# EAGLE design xbee_pc (EAGLE 5.10)
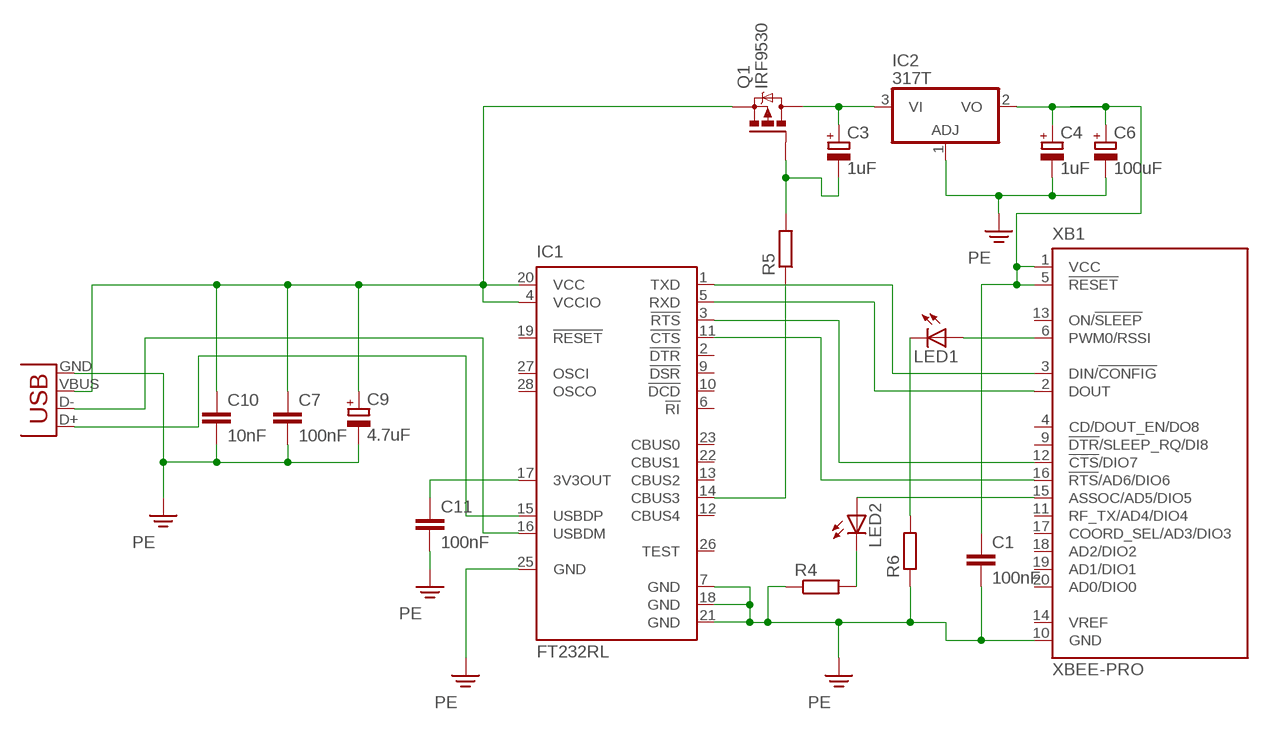
[diagram p0: schematic, sheet 1]

## Parts
C1  100nF  C-EU050-024X044  [C050-024X044]
C3  1uF  CPOL-EUE15-5AXIAL  [E15-5]
C4  1uF  CPOL-EUE15-5AXIAL  [E15-5]
C6  100uF  CPOL-EUE15-5AXIAL  [E15-5]
C7  100nF  C-EU050-024X044  [C050-024X044]
C9  4.7uF  CPOL-EUE15-5AXIAL  [E15-5]
C10  10nF  C-EU050-024X044  [C050-024X044]
C11  100nF  C-EU050-024X044  [C050-024X044]
IC1  FT232RL  [SSOP28]
IC2  317T  [TO220H]
LED1  LED3MM  [LED3MM]
LED2  LED3MM  [LED3MM]
Q1  IRF9530  [TO220BV]
R4  R-EU_M0805  [M0805]
R5  R-EU_M0805  [M0805]
R6  R-EU_M0805  [M0805]
X2  USB-SMD-NS  [USB-MINIB-NOSTOP]
XB1  XBEE-PRO  [XBEE-PRO]

## Nets
N$1: IC1.1(TXD) XB1.3(DIN/!CONFIG)
N$2: IC1.3(!RTS) XB1.12(!CTS!/DIO7)
N$3: IC1.11(!CTS) XB1.16(!RTS!/AD6/DIO6)
N$4: IC1.14(CBUS3) R5.1
N$5: C3.- Q1.G R5.2
N$6: IC1.5(RXD) XB1.2(DOUT)
N$7: C11.1 IC1.17(3V3OUT)
N$8: IC1.16(USBDM) X2.D-
N$9: C7.1 C9.+ C10.1 IC1.4(VCCIO) IC1.20(VCC) Q1.S X2.VBUS
N$10: C1.1 C4.+ C6.+ IC2.2(VO) XB1.1(VCC) XB1.5(!RESET)
N$11: IC1.15(USBDP) X2.D+
N$12: LED1.K(C) R6.2
N$13: LED1.A XB1.6(PWM0/RSSI)
N$14: LED2.A XB1.15(ASSOC/AD5/DIO5)
N$15: LED2.K(C) R4.2
N$16: C3.+ IC2.3(VI) Q1.D
PE: C1.2 C4.- C6.- C7.2 C9.- C10.2 C11.2 IC1.7(GND) IC1.18(GND) IC1.21(GND) IC1.25(GND) IC2.1(ADJ) R4.1 R6.1 X2.GND XB1.10(GND)
Unconnected: IC1.2(!DTR) IC1.6(!RI) IC1.9(!DSR) IC1.10(!DCD) IC1.12(CBUS4) IC1.13(CBUS2) IC1.19(!RESET) IC1.22(CBUS1) IC1.23(CBUS0) IC1.26(TEST) IC1.27(OSCI) IC1.28(OSCO) XB1.4(CD/DOUT_EN/DO8) XB1.9(!DTR!/SLEEP_RQ/DI8) XB1.11(RF_TX/AD4/DIO4) XB1.13(ON/!SLEEP) XB1.14(VREF) XB1.17(COORD_SEL/AD3/DIO3) XB1.18(AD2/DIO2) XB1.19(AD1/DIO1) XB1.20(AD0/DIO0)

## Library data of the parts
C1 C7 C10 C11 = rcl:C-EU: CAPACITOR, European symbol
C3 C4 C6 C9 = rcl:CPOL-EU: POLARIZED CAPACITOR, European symbol
IC1 = ftdichip:FT232R: Source: http://www.ftdichip.com/Documents/DataSheets/DS_FT232R_v104.pdf
IC2 = linear:*317: Positive VOLTAGE REGULATOR
LED1 LED2 = led:LED: LED OSRAM: - CHIPLED LG R971, LG N971, LY N971, LG Q971, LY Q971, LO R971, LY R971 LH N974, LH R974 LS Q976, LO Q976, LY Q976 LO Q996 - Hyper CHIPLED LW Q18S LB Q993, LB Q99A, LB R99A - SideLED LS A670, LO A670, LY A670, LG A670, LP A670 LB A673, LV A673, LT A673, LW A673 LH A674 LY A675 LS A676, LA A676, LO A676, LY A676, LW A676 LS A679, LY A679, LG A679 - Hyper Micro SIDELED® LS Y876, LA Y876, LO Y876, LY Y876 LT Y87S - SmartLED LW L88C, LW L88S LB L89C, LB L89S, LG L890 LS L89K, LO L89K, LY L89K LS L896, LA L896, LO L896, LY L896 - TOPLED LS T670, LO T670, LY T670, LG T670, LP T670 LSG T670, LSP T670, LSY T670, LOP T670, LYG T670 LG T671, LOG T671, LSG T671 LB T673, LV T673, LT T673, LW T673 LH T674 LS T676, LA T676, LO T676, LY T676, LB T676, LH T676, LSB T676, LW T676 LB T67C, LV T67C, LT T67C, LS T67K, LO T67K, LY T67K, LW E67C LS E67B, LA E67B, LO E67B, LY E67B, LB E67C, LV E67C, LT E67C LW T67C LS T679, LY T679, LG T679 LS T770, LO T770, LY T770, LG T770, LP T770 LB T773, LV T773, LT T773, LW T773 LH T774 LS E675, LA E675, LY E675, LS T675 LS T776, LA T776, LO T776, LY T776, LB T776 LHGB T686 LT T68C, LB T68C - Hyper Mini TOPLED® LB M676 - Mini TOPLED Santana® LG M470 LS M47K, LO M47K, LY M47K Source: http://www.osram.convergy.de LUXEON: - LUMILED® LXK2-PW12-R00, LXK2-PW12-S00, LXK2-PW14-U00, LXK2-PW14-V00 LXK2-PM12-R00, LXK2-PM12-S00, LXK2-PM14-U00 LXK2-PE12-Q00, LXK2-PE12-R00, LXK2-PE12-S00, LXK2-PE14-T00, LXK2-PE14-U00 LXK2-PB12-K00, LXK2-PB12-L00, LXK2-PB12-M00, LXK2-PB14-N00, LXK2-PB14-P00, LXK2-PB14-Q00 LXK2-PR12-L00, LXK2-PR12-M00, LXK2-PR14-Q00, LXK2-PR14-R00 LXK2-PD12-Q00, LXK2-PD12-R00, LXK2-PD12-S00 LXK2-PH12-R00, LXK2-PH12-S00 LXK2-PL12-P00, LXK2-PL12-Q00, LXK2-PL12-R00 Source: www.luxeon.com KINGBRIGHT: KA-3528ASYC Source: www.kingbright.com
Q1 = transistor-power:IRF9530: P-CHANNEL HEXFET POWER-MOS-FET Source: http://www.irf.com/product-info/datasheets/data/irf9530.pdf
R4-R6 = rcl:R-EU_: RESISTOR, European symbol
X2 = SparkFun:USB: USB Connectors USB-B-PTH is fully proven SKU : PRT-00139 USB-miniB is fully proven SKU : PRT-00587 USB-A-PCB is untested. USB-A-H is throughly reviewed, but untested. Spark Fun Electronics SKU : PRT-00437 USB-B-SMT is throughly reviewed, but untested. Needs silkscreen touching up. USB-A-S has not been used/tested USB-MB-H has not been used/tested
XB1 = maxstream:XBEE: XBee (TM) /XBee-PRO(TM) OEM RF Modules Source: MaxStream, Inc. xbee_productmanual.pdf

## Board
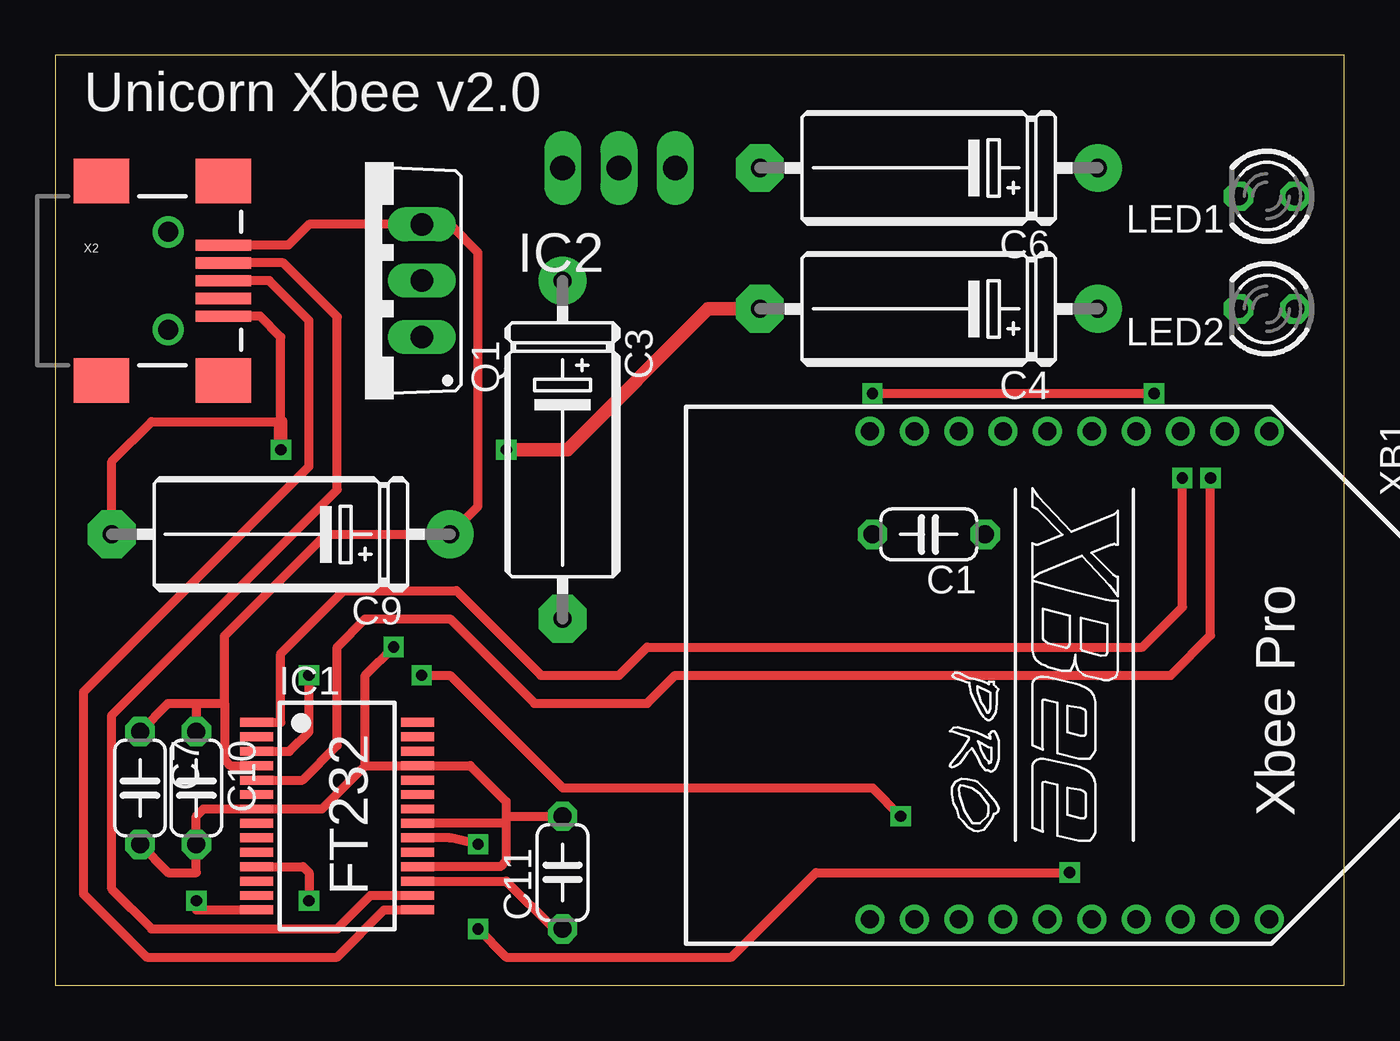
[diagram p1: board, top side]
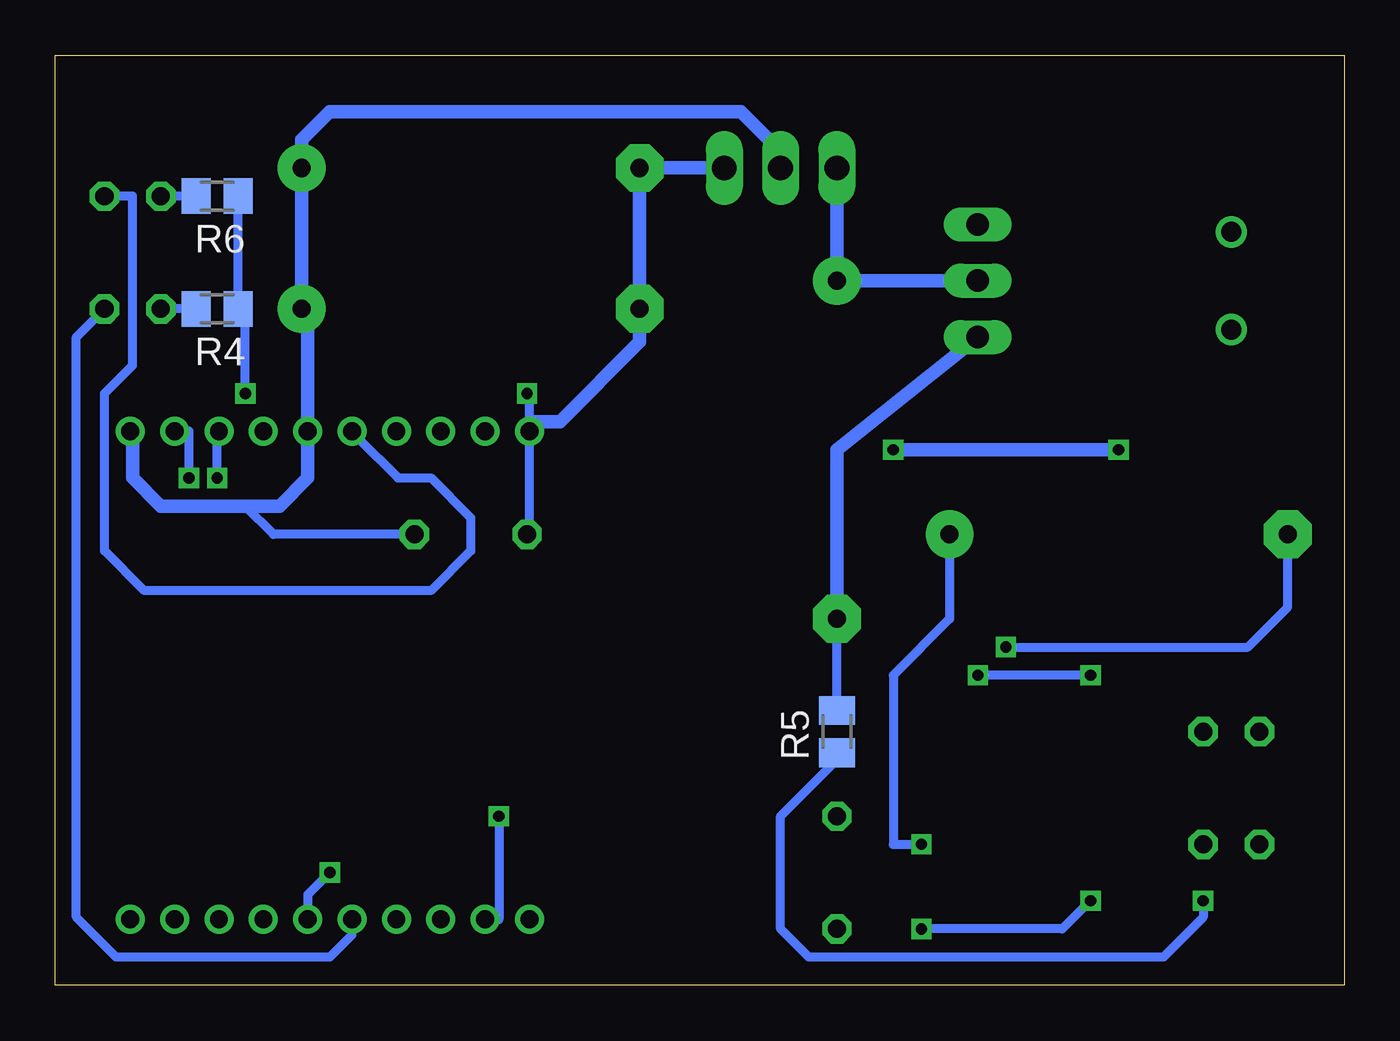
[diagram p2: board, bottom side, seen from below]

Size 58.09 x 41.9 mm. Coordinates in mm from the lower left corner, seen from the top.
Outline: 0,0 58.09,0 58.09,41.9 0,41.9 0,0
Copper layers (1*16): Top 0.035mm / dielectric 1.5mm / Bottom 0.035mm
Design rules "default": minimum track width 10mil, minimum drill 24mil, track to track 8mil, track to pad 8mil, pad to pad 8mil, via to via 8mil, smd to smd 8mil, copper to edge 40mil, drill to drill 8mil, minimum pad ring 10mil, minimum via ring 8mil, stop-mask expansion 4mil, vias tented up to drill 0mil, thermal gap 10mil

### Footprints (pad centres in the part's own frame; a part is rotated, then mirrored left to right if it is on the bottom)
C050-024X044 = drill 0.813 octagon: 1 -2.54,0; 2 2.54,0
E15-5 = drill 0.813 pad 2.159 round: + -7.62,0 | drill 0.813 pad 2.159 octagon: - 7.62,0
SSOP28 = smd 0.4 x 1.5: 1 -4.225,-3.625; 2 -3.575,-3.625; 3 -2.925,-3.625; 4 -2.275,-3.625; 5 -1.625,-3.625; 6 -0.975,-3.625; 7 -0.325,-3.625; 8 0.325,-3.625; 9 0.975,-3.625; 10 1.625,-3.625; 11 2.275,-3.625; 12 2.925,-3.625; 13 3.575,-3.625; 14 4.225,-3.625; 15 4.225,3.625; 16 3.575,3.625; 17 2.925,3.625; 18 2.275,3.625; 19 1.625,3.625; 20 0.975,3.625; 21 0.325,3.625; 22 -0.325,3.625; 23 -0.975,3.625; 24 -1.625,3.625; 25 -2.275,3.625; 26 -2.925,3.625; 27 -3.575,3.625; 28 -4.225,3.625
TO220H = drill 1.118 long: 1 -2.54,0; 2 0,0; 3 2.54,0
LED3MM = drill 0.813 octagon: A -1.27,0; K 1.27,0
TO220BV = drill 1.016 long: D 0,-2.54; G -2.54,-2.54; S 2.54,-2.54
M0805 = smd 1.3 x 1.6: 1 -0.95,0; 2 0.95,0
USB-MINIB-NOSTOP = smd 2.5 x 0.5: D+ 2.5,0; D- 2.5,0.8; GND 2.5,-1.6; ID 2.5,-0.8; VBUS 2.5,1.6 | smd 2.5 x 2: G1 -3,-4.5; G2 -3,4.5; G3 2.5,4.5; G4 2.5,-4.5 | drill 0.9 pad 0.8 round: H1 0,2.2 | drill 0.9 pad 0.787 round: H2 0,-2.2
XBEE-PRO = drill 0.8 pad 1.27 round: 1 -11,9; 2 -11,7; 3 -11,5; 4 -11,3; 5 -11,1; 6 -11,-1; 7 -11,-3; 8 -11,-5; 9 -11,-7; 10 -11,-9; 11 11,-9; 12 11,-7; 13 11,-5; 14 11,-3; 15 11,-1; 16 11,1; 17 11,3; 18 11,5; 19 11,7; 20 11,9

### Placement (x,y rotation side)
C1  39.37,20.32 180 top
C3  22.86,24.13 270 top
C4  39.37,30.48 180 top
C6  39.37,36.83 180 top
C7  3.81,8.89 270 top
C9  10.16,20.32 180 top
C10  6.35,8.89 270 top
C11  22.86,5.08 90 top
IC1  12.7,7.62 270 top
IC2  25.4,36.83 180 top
LED1  54.61,35.56 180 top
LED2  54.61,30.48 180 top
Q1  13.97,31.75 90 top
R4  50.8,30.48 180 bottom
R5  22.86,11.43 90 bottom
R6  50.8,35.56 180 bottom
X2  5.08,31.75 0 top
XB1  45.72,13.97 270 top

### Tracks (layer width: path | path; a pad name or v marks a point on that pad's centre or on a via)
N$1  (via drill 0.51)
  Top 0.406: IC1.1 10.16,11.85 10.16,14.94 13,17.78 18.08,17.78 21.89,13.97 25.4,13.97 26.67,15.24 49,15.24 50.8,17.04 v50.8,22.86
  Bottom 0.406: XB1.3 50.8,24.97 v50.8,22.86
N$2  (via drill 0.51)
  Top 0.406: v38.1,7.62 36.83,8.89 22.86,8.89 17.78,13.97 v16.51,13.97 | IC1.3 10.54,10.54 11.43,11.43 v11.43,13.97
  Bottom 0.406: XB1.12 38.1,2.97 v38.1,7.62 | v11.43,13.97 v16.51,13.97
N$3  (via drill 0.51)
  Top 0.406: IC1.11 11.16,5.34 11.43,5.08 v11.43,3.81 | v19.05,2.54 20.32,1.27 30.48,1.27 34.29,5.08 v45.72,5.08
  Bottom 0.406: v11.43,3.81 12.7,2.54 v19.05,2.54 | v45.72,5.08 46.72,4.08 XB1.16
N$4  (via drill 0.51)
  Top 0.406: IC1.14 6.35,3.4 v6.35,3.81
  Bottom 0.406: v6.35,3.81 6.35,3.07 8.15,1.27 24.13,1.27 25.4,2.54 25.4,7.62 22.86,10.16 R5.1
N$5
  Bottom 0.406: R5.2 C3.-
  Bottom 0.61: C3.- 22.86,24.13 Q1.G
N$6  (via drill 0.51)
  Top 0.406: IC1.5 11.13,9.24 12.7,10.81 12.7,15.24 13.97,16.51 17.78,16.51 21.59,12.7 26.67,12.7 27.94,13.97 50.27,13.97 52.07,15.77 v52.07,22.86
  Bottom 0.406: XB1.2 52.07,24.97 v52.07,22.86
N$7
  Top 0.406: IC1.17 20.32,4.7 22.48,2.54 C11.1
N$8
  Top 0.406: IC1.16 14.21,4.04 12.7,2.54 4.34,2.54 2.54,4.34 2.54,12.17 12.7,22.33 12.7,30.12 10.27,32.55 X2.D-
N$9  (via drill 0.51)
  Top 0.406: X2.VBUS 10.49,33.35 11.43,34.29 Q1.S 17.78,34.29 19.05,33.02 19.05,21.59 C9.+ 12.2,20.32 7.62,15.74 7.62,12.7 | C7.1 5.08,12.7 6.35,12.7 | 6.35,12.7 C10.1 | 7.62,12.7 7.62,10.16 7.88,9.89 IC1.4 | 6.35,12.7 7.62,12.7 | IC1.20 17.78,6.64 v19.05,6.35
  Bottom 0.406: v19.05,6.35 20.32,6.35 20.32,13.97 17.78,16.51 C9.+
N$10
  Bottom 0.406: C1.1 48.26,20.32 49.53,21.59
  Bottom 0.61: XB1.1 54.61,24.97 54.61,22.86 53.34,21.59 49.53,21.59 47.99,21.59 46.72,22.86 XB1.5 46.72,30.48 C4.+ C6.+ 46.99,38.1 45.72,39.37 27.2,39.37 25.4,37.57 IC2.2
N$11
  Top 0.406: IC1.15 14.82,3.4 12.7,1.27 4.11,1.27 1.27,4.11 1.27,13.23 11.43,23.39 11.43,29.95 9.63,31.75 X2.D+
N$12
  Bottom 0.406: R6.2 LED1.K
N$13
  Bottom 0.406: LED1.A 54.61,35.56 54.61,27.94 55.88,26.67 55.88,19.58 54.08,17.78 41.17,17.78 39.37,19.58 39.37,21.06 41.17,22.86 42.65,22.86 44.45,24.66 44.45,24.97 XB1.6
N$14
  Bottom 0.406: XB1.15 44.72,2.27 45.72,1.27 55.35,1.27 57.15,3.07 57.15,29.21 LED2.A
N$15
  Bottom 0.406: R4.2 LED2.K
N$16
  Bottom 0.61: IC2.3 C3.+ Q1.D
PE  (via drill 0.51)
  Top 0.406: v36.83,26.67 v49.53,26.67 | 20.32,7.29 IC1.21 | 20.32,7.29 20.32,5.61 20.05,5.34 IC1.18 | 20.32,7.62 20.32,7.29 | 20.32,7.62 20.32,8.28 18.7,9.89 IC1.25 13.97,9.89 | 20.32,7.62 C11.2 | C7.2 5.08,5.08 6.35,5.08 C10.2 6.35,7.62 6.67,7.95 IC1.7 12.02,7.95 13.97,9.89 | X2.GND 9.22,30.15 10.16,29.21 10.16,25.4 4.34,25.4 2.54,23.6 C9.- | 13.97,9.89 13.97,13.97 v15.24,15.24
  Top 0.61: v20.32,24.13 23.08,24.13 29.43,30.48 C4.- | 10.16,25.4 v10.16,24.13
  Bottom 0.406: R6.1 R4.1 49.53,30.48 v49.53,26.67 | v36.83,26.67 36.72,26.67 XB1.10 36.72,20.32 C1.2 | v15.24,15.24 4.34,15.24 2.54,17.04 C9.-
  Bottom 0.61: IC2.1 C6.- C4.- 31.75,28.99 35.34,25.4 36.72,25.4 XB1.10 | v10.16,24.13 v20.32,24.13

### Text on the board
tPlace: Unicorn Xbee v2.0 | Xbee Pro | FT232